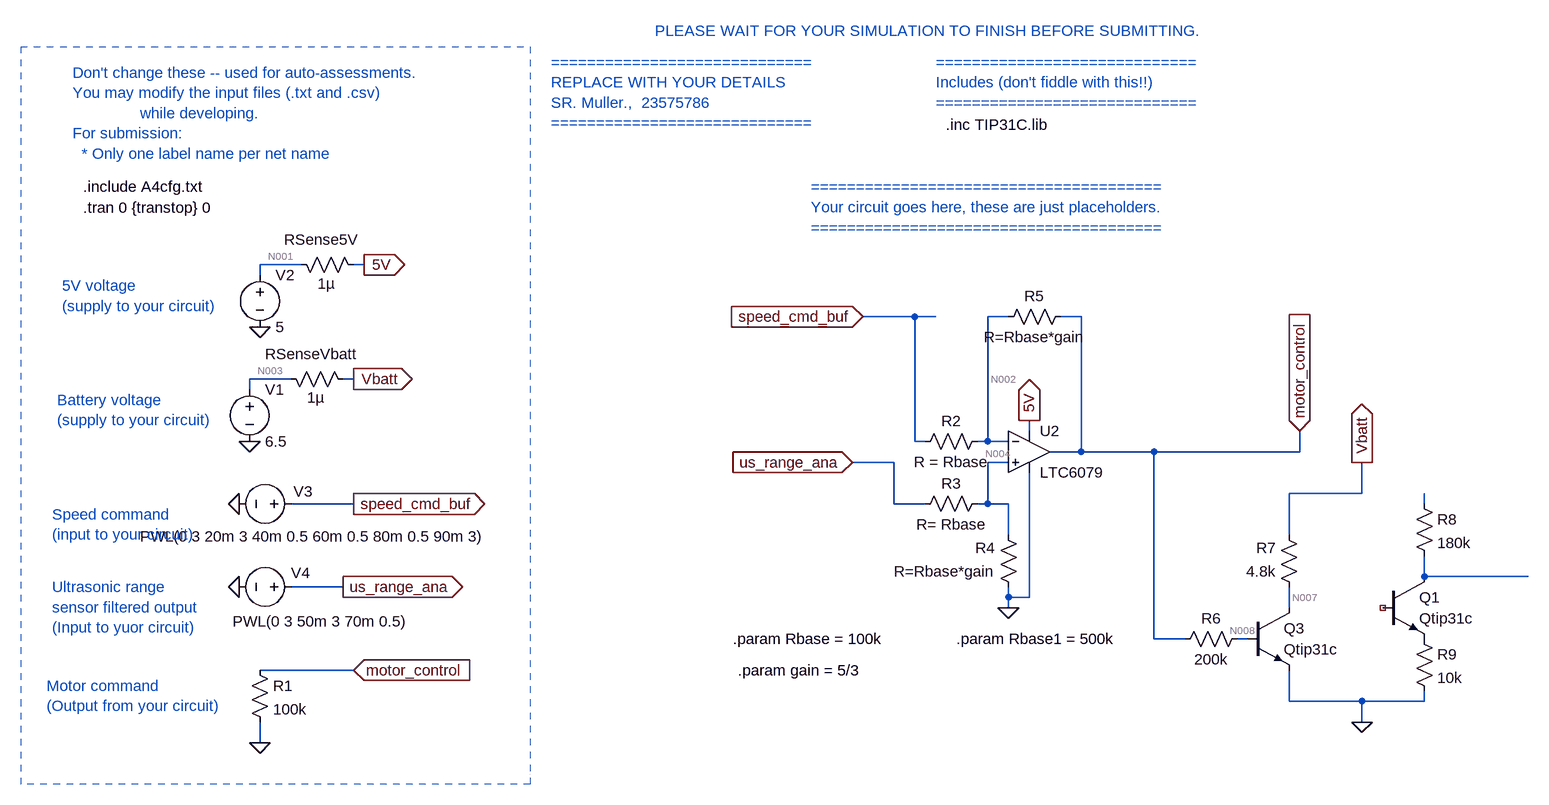
[diagram p0: schematic E344_12345678_A4a.asc]
E344_12345678_A4a.asc, the LTspice schematic file:
Version 4
SHEET 1 1824 2192
WIRE -1936 -1088 -2000 -1088
WIRE -1840 -1088 -1856 -1088
WIRE -2000 -1072 -2000 -1088
WIRE -992 -1008 -1072 -1008
WIRE -960 -1008 -992 -1008
WIRE -848 -1008 -880 -1008
WIRE -736 -1008 -768 -1008
WIRE -1952 -912 -2016 -912
WIRE -1856 -912 -1872 -912
WIRE -2016 -896 -2016 -912
WIRE -816 -832 -816 -848
WIRE -992 -816 -992 -1008
WIRE -976 -816 -992 -816
WIRE -880 -816 -880 -1008
WIRE -880 -816 -896 -816
WIRE -848 -816 -880 -816
WIRE -736 -800 -736 -1008
WIRE -736 -800 -784 -800
WIRE -624 -800 -736 -800
WIRE -400 -800 -400 -832
WIRE -400 -800 -624 -800
WIRE -1024 -784 -1088 -784
WIRE -848 -784 -880 -784
WIRE -304 -736 -304 -784
WIRE -304 -736 -416 -736
WIRE -1856 -720 -1952 -720
WIRE -1024 -720 -1024 -784
WIRE -976 -720 -1024 -720
WIRE -880 -720 -880 -784
WIRE -880 -720 -896 -720
WIRE -848 -720 -880 -720
WIRE -208 -720 -208 -736
WIRE -848 -672 -848 -720
WIRE -416 -672 -416 -736
WIRE -208 -608 -208 -640
WIRE -48 -608 -208 -608
WIRE -1872 -592 -1952 -592
WIRE -848 -576 -848 -592
WIRE -816 -576 -816 -768
WIRE -816 -576 -848 -576
WIRE -848 -560 -848 -576
WIRE -416 -560 -416 -592
WIRE -624 -512 -624 -800
WIRE -576 -512 -624 -512
WIRE -480 -512 -496 -512
WIRE -1856 -464 -2000 -464
WIRE -416 -416 -416 -464
WIRE -304 -416 -416 -416
WIRE -208 -416 -208 -432
WIRE -208 -416 -304 -416
WIRE -304 -384 -304 -416
WIRE -2000 -352 -2000 -384
FLAG -1840 -1088 5V
IOPIN -1840 -1088 Out
FLAG -2000 -992 0
FLAG -1072 -1008 speed_cmd_buf
IOPIN -1072 -1008 In
FLAG -400 -832 motor_control
IOPIN -400 -832 In
FLAG -1088 -784 us_range_ana
IOPIN -1088 -784 In
FLAG -1856 -912 Vbatt
IOPIN -1856 -912 Out
FLAG -2016 -816 0
FLAG -1856 -720 speed_cmd_buf
IOPIN -1856 -720 Out
FLAG -1872 -592 us_range_ana
IOPIN -1872 -592 Out
FLAG -2032 -720 0
FLAG -2032 -592 0
FLAG -1856 -464 motor_control
IOPIN -1856 -464 In
FLAG -2000 -352 0
FLAG -848 -560 0
FLAG -816 -848 5V
IOPIN -816 -848 Out
FLAG -304 -384 0
FLAG -304 -784 Vbatt
IOPIN -304 -784 Out
SYMBOL voltage -2000 -1088 R0
WINDOW 123 0 0 Left 0
WINDOW 39 0 0 Left 0
SYMATTR InstName V2
SYMATTR Value 5
SYMBOL res -1952 -1104 M90
WINDOW 0 -7 47 VBottom 2
WINDOW 3 29 54 VTop 2
SYMATTR InstName RSense5V
SYMATTR Value 1µ
SYMBOL Opamps\\LTC6079 -816 -800 R0
SYMATTR InstName U2
SYMBOL voltage -2016 -912 R0
WINDOW 123 0 0 Left 0
WINDOW 39 0 0 Left 0
SYMATTR InstName V1
SYMATTR Value 6.5
SYMBOL res -1968 -928 M90
WINDOW 0 -7 47 VBottom 2
WINDOW 3 29 54 VTop 2
SYMATTR InstName RSenseVbatt
SYMATTR Value 1µ
SYMBOL voltage -1936 -720 R90
WINDOW 123 0 0 Left 0
WINDOW 39 0 0 Left 0
WINDOW 0 -19 -17 VRight 2
WINDOW 3 50 -286 VRight 2
SYMATTR InstName V3
SYMATTR Value PWL(0 3 20m 3 40m 0.5 60m 0.5 80m 0.5 90m 3)
SYMBOL voltage -1936 -592 R90
WINDOW 123 0 0 Left 0
WINDOW 39 0 0 Left 0
WINDOW 0 -22 -13 VRight 2
WINDOW 3 53 -165 VRight 2
SYMATTR InstName V4
SYMATTR Value PWL(0 3 50m 3 70m 0.5)
SYMBOL res -2016 -480 R0
SYMATTR InstName R1
SYMATTR Value 100k
SYMBOL res -880 -832 R90
WINDOW 0 0 56 VBottom 2
WINDOW 3 32 56 VTop 2
SYMATTR InstName R2
SYMATTR Value R = Rbase
SYMBOL res -880 -736 R90
WINDOW 0 0 56 VBottom 2
WINDOW 3 32 56 VTop 2
SYMATTR InstName R3
SYMATTR Value R= Rbase
SYMBOL res -832 -576 R180
WINDOW 0 36 76 Left 2
WINDOW 3 36 40 Left 2
SYMATTR InstName R4
SYMATTR Value R=Rbase*gain
SYMBOL res -864 -992 R270
WINDOW 0 32 56 VTop 2
WINDOW 3 0 56 VBottom 2
SYMATTR InstName R5
SYMATTR Value R=Rbase*gain
SYMBOL npn2 -480 -560 R0
WINDOW 3 56 64 Left 2
SYMATTR InstName Q3
SYMATTR Value Qtip31c
SYMBOL npn2 -272 -608 R0
WINDOW 3 56 64 Left 2
SYMATTR InstName Q1
SYMATTR Value Qtip31c
SYMBOL res -480 -528 R90
WINDOW 0 0 56 VBottom 2
WINDOW 3 32 56 VTop 2
SYMATTR InstName R6
SYMATTR Value 200k
SYMBOL res -400 -576 R180
WINDOW 0 36 76 Left 2
WINDOW 3 36 40 Left 2
SYMATTR InstName R7
SYMATTR Value 4.8k
SYMBOL res -224 -736 R0
SYMATTR InstName R8
SYMATTR Value 180k
SYMBOL res -224 -528 R0
SYMATTR InstName R9
SYMATTR Value 10k
TEXT -2288 -1384 Left 2 ;Don't change these -- used for auto-assessments.\nYou may modify the input files (.txt and .csv) \n               while developing.\nFor submission: \n  * Only one label name per net name
TEXT -1552 -1400 Left 2 ;=============================\nREPLACE WITH YOUR DETAILS\nSR. Muller.,  23575786\n=============================
TEXT -960 -1400 Left 2 ;=============================\nIncludes (don't fiddle with this!!)\n=============================
TEXT -1152 -1208 Left 2 ;=======================================\nYour circuit goes here, these are just placeholders.\n=======================================
TEXT -1392 -1448 Left 2 ;PLEASE WAIT FOR YOUR SIMULATION TO FINISH BEFORE SUBMITTING.
TEXT -2272 -1176 Left 2 !.tran 0 {transtop} 0
TEXT -2272 -1208 Left 2 !.include A4cfg.txt
TEXT -2320 -704 Left 2 ;Speed command\n(input to your circuit)
TEXT -2320 -592 Left 2 ;Ultrasonic range\nsensor filtered output\n(Input to yuor circuit)
TEXT -2328 -440 Left 2 ;Motor command\n(Output from your circuit)
TEXT -2312 -880 Left 2 ;Battery voltage \n(supply to your circuit)
TEXT -2304 -1056 Left 2 ;5V voltage \n(supply to your circuit)
TEXT -1272 -512 Left 2 !.param Rbase = 100k
TEXT -1264 -464 Left 2 !.param gain = 5/3
TEXT -928 -512 Left 2 !.param Rbase1 = 500k
TEXT -944 -1304 Left 2 !.inc TIP31C.lib
LINE Normal -1584 -1424 -1584 -288 2
LINE Normal -2368 -1424 -1584 -1424 2
LINE Normal -1584 -288 -2368 -288 2
LINE Normal -1584 -304 -1584 -304 2
LINE Normal -2368 -1424 -2368 -288 2

The netlist it stands for:
* E344_12345678_A4a.asc
V2 N001 0 5
RSense5V N001 5V 1µ
XU2 N004 N002 5V 0 motor_control LTC6078  ; LTC6079, pins In+ In- V+ V- OUT
V1 N003 0 6.5
RSenseVbatt N003 Vbatt 1µ
V3 speed_cmd_buf 0 PWL(0 3 20m 3 40m 0.5 60m 0.5 80m 0.5 90m 3)
V4 us_range_ana 0 PWL(0 3 50m 3 70m 0.5)
R1 motor_control 0 100k
R2 N002 speed_cmd_buf R = Rbase
R3 N004 us_range_ana R= Rbase
R4 0 N004 R=Rbase*gain
R5 N002 motor_control R=Rbase*gain
Q3 N007 N008 0 0 Qtip31c
Q1 N006 NC_01 P001 0 Qtip31c
R6 N008 motor_control 200k
R7 N007 Vbatt 4.8k
R8 N005 N006 180k
R9 P001 0 10k
.model NPN NPN
.model PNP PNP
.lib standard.bjt
* Don't change these -- used for auto-assessments.
* You may modify the input files (.txt and .csv)
*                while developing.
* For submission:
*   * Only one label name per net name
* =============================
* REPLACE WITH YOUR DETAILS
* SR. Muller.,  23575786
* =============================
* =============================
* Includes (don't fiddle with this!!)
* =============================
* =======================================
* Your circuit goes here, these are just placeholders.
* =======================================
* PLEASE WAIT FOR YOUR SIMULATION TO FINISH BEFORE SUBMITTING.
.tran 0 {transtop} 0
.include A4cfg.txt
* Speed command
* (input to your circuit)
* Ultrasonic range
* sensor filtered output
* (Input to yuor circuit)
* Motor command
* (Output from your circuit)
* Battery voltage
* (supply to your circuit)
* 5V voltage
* (supply to your circuit)
.param Rbase = 100k
.param gain = 5/3
.param Rbase1 = 500k
.inc TIP31C.lib
.lib LTC5.lib
.backanno
.end

* Results of the author's LTspice run, read from the files saved beside the schematic
* Operating Point, zero values left out:
*   V(n001) = 5 V
*   V(5v) = 5 V
*   V(n004) = 1.875 V
*   V(n002) = 1.875 V
*   V(motor_control) = 622.7 µV
*   V(n003) = 6.5 V
*   V(vbatt) = 6.5 V
*   V(speed_cmd_buf) = 3 V
*   V(us_range_ana) = 3 V
*   V(n007) = 6.5 V
*   V(n008) = 2.812 mV
*   I(R5) = 11.25 µA
*   I(R4) = -11.25 µA
*   I(R3) = -11.25 µA
*   I(R2) = -11.25 µA
*   Ic(Q3) = 12.81 nA
*   Ib(Q3) = -10.95 nA
*   Ie(Q3) = -1.859 nA
*   I(R7) = -12.81 nA
*   I(R6) = 10.95 nA
*   I(R1) = 6.227 nA
*   I(Rsensevbatt) = 12.43 nA
*   I(Rsense5v) = 36.04 µA
*   I(V4) = -11.25 µA
*   I(V3) = -11.25 µA
*   I(V1) = -12.11 nA
*   I(V2) = -36.04 µA
*   Ix(u2:3) = 36.04 µA
*   Ix(u2:4) = -47.29 µA
*   Ix(u2:5) = 11.25 µA
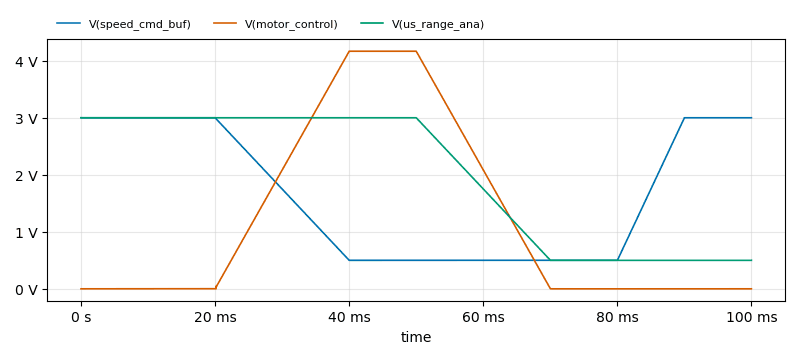
[diagram p1: Transient Analysis of E344_12345678_A4a.asc, plotted from the saved traces]
* Transient Analysis, 1 run:
*   V(speed_cmd_buf): min 500 mV, max 3 V, average 1.625 V, rms 1.995 V, last 3 V
*   V(motor_control): min 126.5 µV, max 4.167 V, average 1.25 V, rms 2.016 V, last 622.6 µV
*   V(us_range_ana): min 500 mV, max 3 V, average 2 V, rms 2.301 V, last 500 mV